# EAGLE design ahrs (EAGLE 7.7.0)
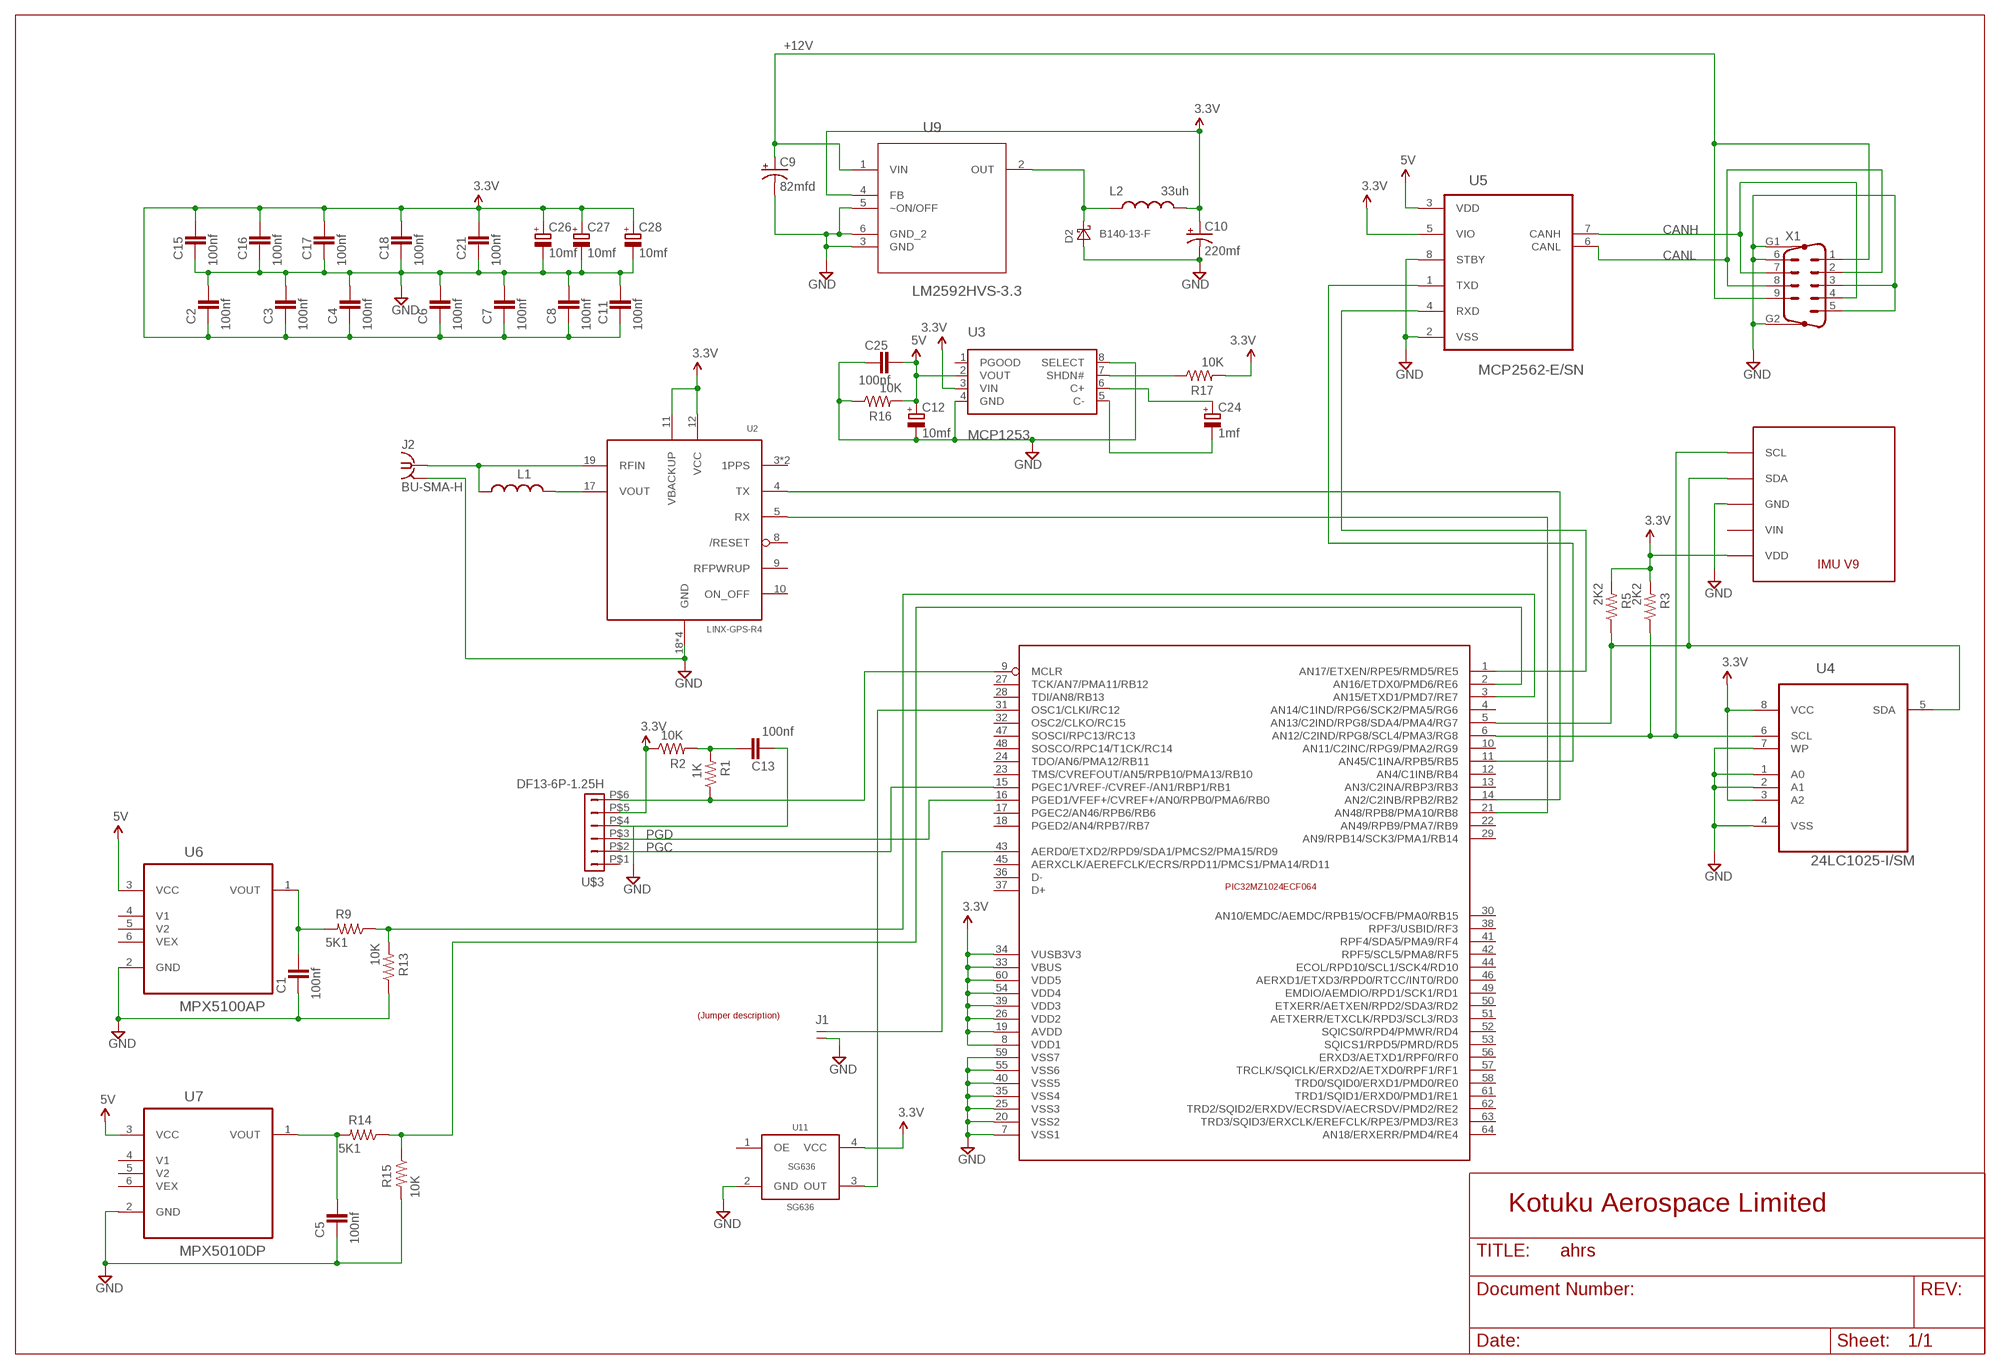
[diagram p0: schematic, sheet 1]

## Parts
C1  100nf  CAPACITOR_NPOL-0805  [C805]
C2  100nf  CAPACITOR_NPOL-0805  [C805]
C3  100nf  CAPACITOR_NPOL-0805  [C805]
C4  100nf  CAPACITOR_NPOL-0805  [C805]
C5  100nf  CAPACITOR_NPOL-0805  [C805]
C6  100nf  CAPACITOR_NPOL-0805  [C805]
C7  100nf  CAPACITOR_NPOL-0805  [C805]
C8  100nf  CAPACITOR_NPOL-0805  [C805]
C9  82mfd  CAPACITOR_POL-SVPF-E7  [SVPF-E7]
C10  220mf  CAP_POL7343  [EIA7343]
C11  100nf  CAPACITOR_NPOL-0805  [C805]
C12  10mf  CAPACITOR_POL-SMC_A  [SMC_A]
C13  100nf  CAPACITOR_NPOL-0805  [C805]
C15  100nf  CAPACITOR_NPOL-0805  [C805]
C16  100nf  CAPACITOR_NPOL-0805  [C805]
C17  100nf  CAPACITOR_NPOL-0805  [C805]
C18  100nf  CAPACITOR_NPOL-0805  [C805]
C21  100nf  CAPACITOR_NPOL-0805  [C805]
C24  1mf  CAPACITOR_POL-SMC_A  [SMC_A]
C25  100nf  CAPACITOR_NPOL-0805  [C805]
C26  10mf  CAPACITOR_POL-SMC_A  [SMC_A]
C27  10mf  CAPACITOR_POL-SMC_A  [SMC_A]
C28  10mf  CAPACITOR_POL-SMC_A  [SMC_A]
D2  B140-13-F  DIODE-SCHOTTKY-SMA  [SMA]
J1  JUMPER-1X2  [JUMPER-1X2]
J2  BU-SMA-H  [BU-SMA-H]
L1  FERRITE-0603  [FB603]
L2  33uh  INDUCTOR  [1812]
R1  1K  RESISTOR0603-RES  [0603-RES]
R2  10K  RESISTOR0603-RES  [0603-RES]
R3  2K2  RESISTOR0603-RES  [0603-RES]
R5  2K2  RESISTOR0603-RES  [0603-RES]
R9  5K1  RESISTOR0603-RES  [0603-RES]
R13  10K  RESISTOR0603-RES  [0603-RES]
R14  5K1  RESISTOR0603-RES  [0603-RES]
R15  10K  RESISTOR0603-RES  [0603-RES]
R16  10K  RESISTOR0603-RES  [0603-RES]
R17  10K  RESISTOR0603-RES  [0603-RES]
U2  LINX-GPS-R4  [LINX-R4]
U3  MCP1253  [MSOP8]
U4  24LC1025-I/SM  [SOIC8-N_MC]
U5  MCP2562-E/SN  [SOIC-8N]
U6  MPX5100AP  [FREESCALE_CASE_867B-04]
U7  MPX5010DP  MPX5100AP  [FREESCALE_CASE_867B-04]
U8  IMUV9  [IMUV9]
U9  LM2592HVS-3.3  LM2592HVS-5.0  [TO170P1435X457-5N]
U11  SG636  [SG636]
U$1  LABEL_JUMPER_1X2  [JUMP2_DESC]
U$2  PIC32MZ1024  [TQFP-64]
U$3  DF13-6P-1.25H  [DF13A-6P-1.25H]
X1  M09HP  [M09HP]

## Nets
3.3V: C2.2 C3.2 C4.2 C6.2 C7.2 C8.2 C10.A(+) C11.2 C15.1 C16.1 C17.1 C18.1 C21.1 C26.+ C27.+ C28.+ L2.2 R2.1 R3.2 R5.2 R17.2 U2.11(VBACKUP) U2.12(VCC) U3.3(VIN) U4.3(A2) U4.8(VCC) U5.5(VIO) U8.VDD U9.4(FB) U11.4(VCC) U$2.8(VDD1) U$2.19(AVDD) U$2.26(VDD2) U$2.33(VBUS) U$2.34(VUSB3V3) U$2.39(VDD3) U$2.54(VDD4) U$2.60(VDD5) U$3.P$5
5V: C12.+ C25.1 R16.2 U3.2(VOUT) U5.3(VDD) U6.3(VCC) U7.3(VCC)
!MCLR: R1.1 U$2.9(MCLR) U$3.P$6
+12V: C9.P$2(+) U9.1(VIN) X1.1 X1.9
CANH: U5.7(CANH) X1.4 X1.7
CANL: U5.6(CANL) X1.2 X1.8
GND: C1.2 C2.1 C3.1 C4.1 C5.2 C6.1 C7.1 C8.1 C9.P$1(-) C10.C(-) C11.1 C12.- C13.2 C15.2 C16.2 C17.2 C18.2 C21.2 C25.2 C26.- C27.- C28.- D2.A J1.2 J2.2 J2.3 J2.4 J2.5 R13.1 R15.2 R16.1 U2.18(GND) U2.20(GND) U2.21(GND) U2.22(GND) U3.4(GND) U3.8(SELECT) U4.1(A0) U4.2(A1) U4.4(VSS) U4.7(WP) U5.2(VSS) U5.8(STBY) U6.2(GND) U7.2(GND) U8.GND U9.3(GND) U9.5(~ON/OFF) U9.6(GND_2) U11.2(GND) U$2.7(VSS1) U$2.20(VSS2) U$2.25(VSS3) U$2.35(VSS4) U$2.40(VSS5) U$2.55(VSS6) U$2.59(VSS7) U$3.P$4 X1.3 X1.5 X1.6 X1.G1 X1.G2
N$1: L1.2 U2.17(VOUT)
N$2: J2.1 L1.1 U2.19(RFIN)
N$3: U5.4(RXD) U$2.1(AN17/ETXEN/RPE5/RMD5/RE5)
N$5: U11.3(OUT) U$2.31(OSC1/CLKI/RC12)
N$6: C13.1 R1.2 R2.2
N$7: C1.1 R9.2 U6.1(VOUT)
N$8: R9.1 R13.2 U$2.3(AN15/ETXD1/PMD7/RE7)
N$11: C5.1 R14.2 U7.1(VOUT)
N$12: D2.C L2.1 U9.2(OUT)
N$16: U2.4(TX) U$2.14(AN2/C2INB/RPB2/RB2)
N$20: U2.5(RX) U$2.21(AN48/RPB8/PMA10/RB8)
N$25: J1.1 U$2.43(AERD0/ETXD2/RPD9/SDA1/PMCS2/PMA15/RD9)
N$26: U5.1(TXD) U$2.11(AN45/C1INA/RPB5/RB5)
N$36: R17.1 U3.7(SHDN#)
N$37: C24.- U3.5(C-)
N$38: C24.+ U3.6(C+)
PGC: U$2.15(PGEC1/VREF-/CVREF-/AN1/RBP1/RB1) U$3.P$2
PGD: U$2.16(PGED1/VFEF+/CVREF+/AN0/RPB0/PMA6/RB0) U$3.P$3
PITOT: R14.1 R15.1 U$2.2(AN16/ETDX0/PMD6/RE6)
SCL: R3.1 U4.6(SCL) U8.SCL U$2.6(AN12/C2IND/RPG8/SCL4/PMA3/RG8)
SDA: R5.1 U4.5(SDA) U8.SDA U$2.5(AN13/C2IND/RPG8/SDA4/PMA4/RG7)
Unconnected: U2.3(1PPS) U2.7(1PPS) U2.8(/RESET) U2.9(RFPWRUP) U2.10(ON_OFF) U3.1(PGOOD) U6.4(V1) U6.5(V2) U6.6(VEX) U7.4(V1) U7.5(V2) U7.6(VEX) U11.1(OE) U$2.4(AN14/C1IND/RPG6/SCK2/PMA5/RG6) U$2.10(AN11/C2INC/RPG9/PMA2/RG9) U$2.12(AN4/C1INB/RB4) U$2.13(AN3/C2INA/RBP3/RB3) U$2.17(PGEC2/AN46/RPB6/RB6) U$2.18(PGED2/AN4/RPB7/RB7) U$2.22(AN49/RPB9/PMA7/RB9) U$2.23(TMS/CVREFOUT/AN5/RPB10/PMA13/RB10) U$2.24(TDO/AN6/PMA12/RB11) U$2.27(TCK/AN7/PMA11/RB12) U$2.28(TDI/AN8/RB13) U$2.29(AN9/RPB14/SCK3/PMA1/RB14) U$2.30(AN10/EMDC/AEMDC/RPB15/OCFB/PMA0/RB15) U$2.32(OSC2/CLKO/RC15) U$2.36(D-) U$2.37(D+) U$2.38(RPF3/USBID/RF3) U$2.41(RPF4/SDA5/PMA9/RF4) U$2.42(RPF5/SCL5/PMA8/RF5) U$2.44(ECOL/RPD10/SCL1/SCK4/RD10) U$2.45(AERXCLK/AEREFCLK/ECRS/RPD11/PMCS1/PMA14/RD11) U$2.46(AERXD1/ETXD3/RPD0/RTCC/INT0/RD0) U$2.47(SOSCI/RPC13/RC13) U$2.48(SOSCO/RPC14/T1CK/RC14) U$2.49(EMDIO/AEMDIO/RPD1/SCK1/RD1) U$2.50(ETXERR/AETXEN/RPD2/SDA3/RD2) U$2.51(AETXERR/ETXCLK/RPD3/SCL3/RD3) U$2.52(SQICS0/RPD4/PMWR/RD4) U$2.53(SQICS1/RPD5/PMRD/RD5) U$2.56(ERXD3/AETXD1/RPF0/RF0) U$2.57(TRCLK/SQICLK/ERXD2/AETXD0/RPF1/RF1) U$2.58(TRD0/SQID0/ERXD1/PMD0/RE0) U$2.61(TRD1/SQID1/ERXD0/PMD1/RE1) U$2.62(TRD2/SQID2/ERXDV/ECRSDV/AECRSDV/PMD2/RE2) U$2.63(TRD3/SQID3/ERXCLK/EREFCLK/RPE3/PMD3/RE3) U$2.64(AN18/ERXERR/PMD4/RE4) U$3.P$1

## Notes on the sheet
- Kotuku Aerospace Limited

## Power pins joined to a net without a drawn wire
VIN: U8.VIN

## Library data of the parts
C1-C8 C11 C13 C15-C18 C21 C25 = dp_devices:CAPACITOR_NPOL: Non-Polarized capacitor in various packages
C9 = kotuku:CAPACITOR_POL: Polarized capacitor in various packages
C10 = SparkFun:CAP_POL: Capacitor Polarized These are standard SMD and PTH capacitors. Normally 10uF, 47uF, and 100uF in electrolytic and tantalum varieties. Always verify the external diameter of the through hole cap, it varies with capacity, voltage, and manufacturer. The EIA devices should be standard.
C12 C24 C26-C28 = dp_devices:CAPACITOR_POL: Polarized capacitor in various packages
D2 = diode2:DIODE-SCHOTTKY-: SCHOTTKY DIODE
J1 = QuantumOptics:JUMPER-1X2: Jumper, header, SIP on 0.1" grid, for option selection.
J2 = con-coax:BU-SMA-H: FEMALE SMA CONNECTOR Radiall; OC_FARNELL: unknown; OC_NEWARK: unknown; PARTNO: 5-1814400-1
L1 = kotuku:FERRITE: Ferrite bead in various packages
L2 = SparkFun:INDUCTOR: Inductors Basic Inductor/Choke - 0603 and 1206. Footprints are not proven and vary greatly between part numbers.
R1-R3 R5 R9 R13-R17 = SparkFun-Passives:RESISTOR: Resistor Basic schematic elements and footprints for 0603, 1206, and PTH resistors.; PARTNO: ERJ-3GEYJ103V
U2 = Supernode-Sensors:LINX-GPS-R4; PARTNO: RXM-GPS-R4-T
U3 = microchip-dspic:MCP1253: Positive-Regulated Charge Pump (3.3x5.0)
U4 = Microchip_By_element14_Batch_1:24LC1025-I/SM: 1024K I2C CMOS Serial EEPROM
U5 = Microchip-MCP2562-E_SN:MCP2562-E/SN: High-Speed CAN Transceiver,SOIC-8
U6 U7 = MPX5100AP:MPX5100AP: IC, PRESSURE SENSOR, 0 TO 100KPA, SIP-6; MPN: MPX5100AP; OC_FARNELL: 1457156; OC_NEWARK: 07F9928; PACKAGE: CASE 867B-04; SUPPLIER: FREESCALE SEMICONDUCTOR
U8 = POLULU:IMUV9
U9 = NSC_By_element14_Batch_1.1:LM2592HVS-5.0: SIMPLE SWITCHER; MPN: LM2592HVS-5.0; OC_FARNELL: -; OC_NEWARK: 41K3791; PACKAGE: TO-263-5; SUPPLIER: National Semiconductor
U11 = epson:SG636; PARTNO: SG-636PCE 10.000MHZ
U$1 = dp_devices:LABEL_JUMPER_1X2: Nice formatted two legged jumperdescription Use attributes to change the values ON = With jumper OFF = Without jumper; OFF: Normal; ON: Reset
U$2 = PIC32MZ1024ECF064:PIC32MZ1024
U$3 = con-hirose-df13:DF13-6P-1.25: DF13-6P 1.25mm Pitch Miniature Crimping Connector.
X1 = con-subd:M09HP: SUB-D; OC_FARNELL: unknown; OC_NEWARK: unknown

## Net classes
0 default: width 0.152 mm, drill 0.305 mm, clearance 0.152 mm
2 12v: width 1.27 mm, drill 0.305 mm, clearance 0.305 mm

## Board
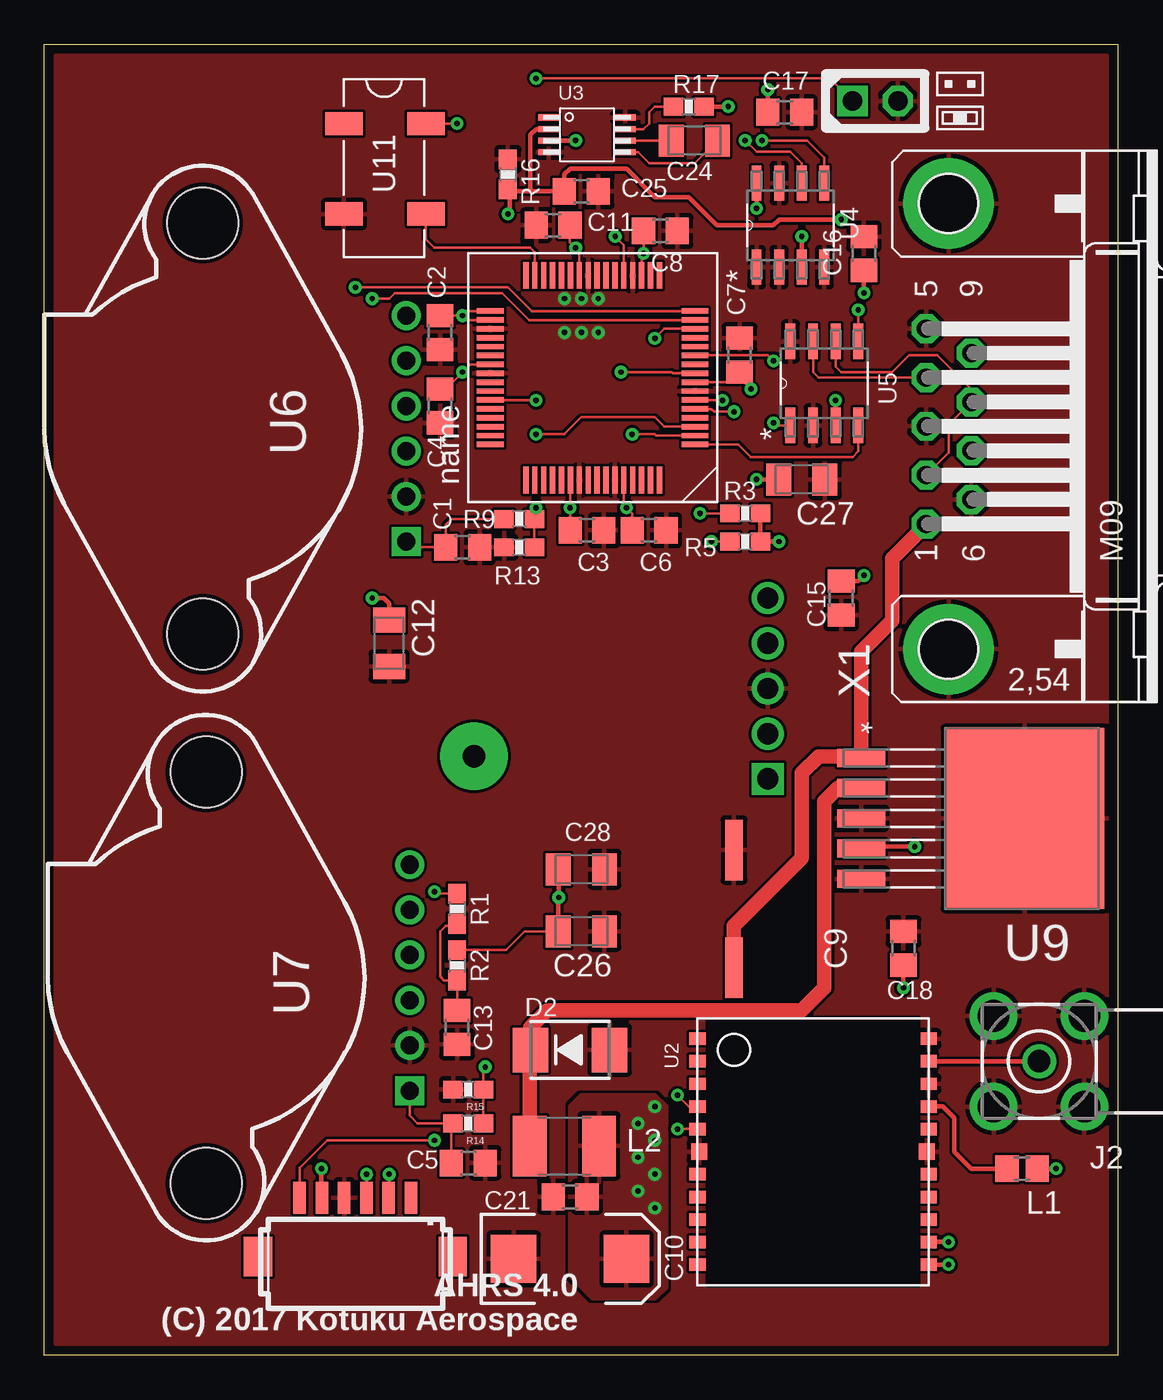
[diagram p1: board, top side]
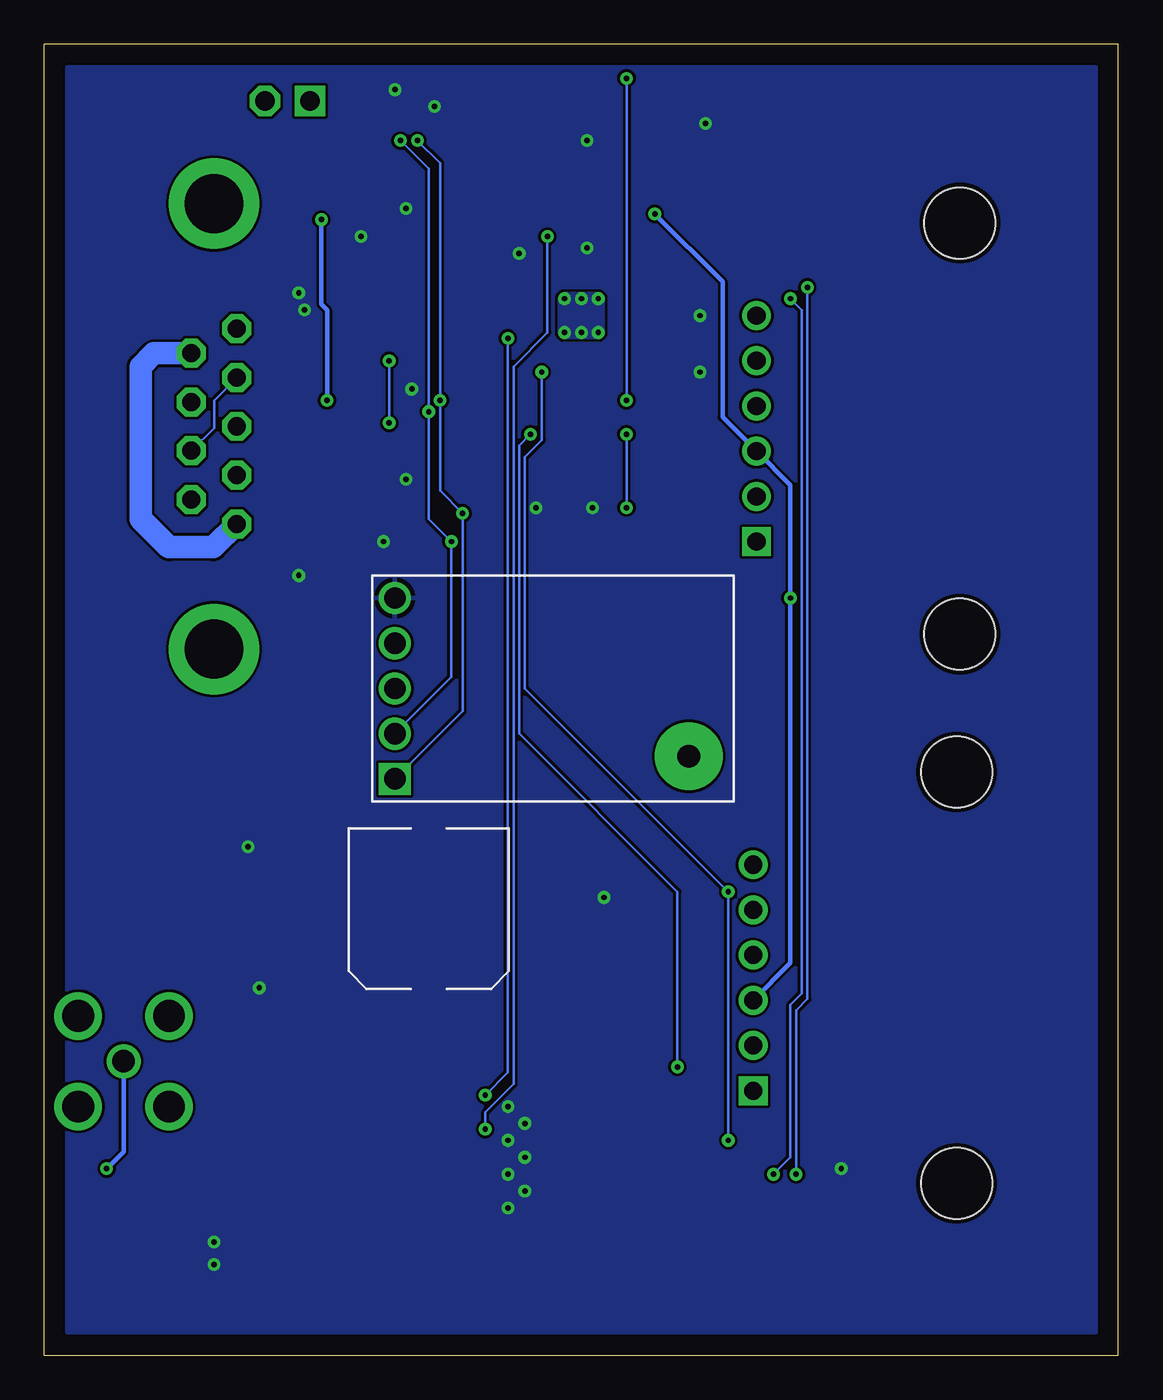
[diagram p2: board, bottom side, seen from below]

Size 60.33 x 73.66 mm. Coordinates in mm from the lower left corner, seen from the top.
Outline: 60.33,0 0,0 0,73.66 60.33,73.66 60.33,0
Copper layers (1*16): Top 0.035mm / dielectric 1.5mm / Bottom 0.035mm
Design rules "DFRobot_Eagle_Rule_v0.4": minimum track width 6mil, minimum drill 12mil, track to track 6mil, track to pad 6mil, pad to pad 6mil, via to via 6mil, smd to smd 0mil, copper to edge 10mil, drill to drill 10mil, minimum pad ring 12mil, minimum via ring 8mil, stop-mask expansion 2mil, vias tented up to drill 25mil, thermal gap 10mil

### Footprints (pad centres in the part's own frame; a part is rotated, then mirrored left to right if it is on the bottom)
C805 = smd 1.3 x 1.5: 1 -0.95,0; 2 0.95,0
SVPF-E7 = smd 1 x 3.4: P$1 0,3.3; P$2 0,-3.3
EIA7343 = smd 2.55 x 2.7: A 3.17,0; C -3.17,0
SMC_A = smd 1.4 x 1.8: + -1.3,0; - 1.3,0
SMA = smd 2 x 2.5: A 2.223,0; C -2.223,0
JUMPER-1X2 = drill 1.092 square: 1 0,2.54 | drill 1.092 octagon: 2 0,0
BU-SMA-H = drill 1.27: 1 0,0 | drill 1.778: 2 -2.55,2.55; 3 2.55,2.55; 4 2.55,-2.55; 5 -2.55,-2.55
FB603 = smd 1.3 x 1.5: 1 -0.85,0; 2 0.85,0
1812 = smd 1.9 x 3.4: 1 -1.95,0; 2 1.95,0
0603-RES = smd 1.1 x 1: 1 -0.85,0; 2 0.85,0
LINX-R4 = smd 0.7 x 0.92: 1 -6.35,-6.5; 2 -5.08,-6.5; 3 -3.81,-6.5; 4 -2.54,-6.5; 5 -1.27,-6.5; 6 1.27,-6.5; 7 2.54,-6.5; 8 3.81,-6.5; 9 5.08,-6.5; 10 6.35,-6.5; 11 6.35,6.5; 12 5.08,6.5; 13 3.81,6.5; 14 2.54,6.5; 15 1.27,6.5; 16 -1.27,6.5; 17 -2.54,6.5; 18 -3.81,6.5; 19 -5.08,6.5; 20 -6.35,6.5 | smd 0.92 x 0.92: 21 0,-6.39; 22 0,6.39
MSOP8 = smd 1.2 x 0.35: 1 -2.145,0.975; 2 -2.145,0.325; 3 -2.145,-0.325; 4 -2.145,-0.975; 5 2.145,-0.975; 6 2.145,-0.325; 7 2.145,0.325; 8 2.145,0.975
SOIC8-N_MC = smd 1.981 x 0.559: 1 -2.362,1.905; 2 -2.362,0.635; 3 -2.362,-0.635; 4 -2.362,-1.905; 5 2.362,-1.905; 6 2.362,-0.635; 7 2.362,0.635; 8 2.362,1.905
SOIC-8N = smd 1.981 x 0.559: 1 1.448,5.715; 2 1.448,4.445; 3 1.448,3.175; 4 1.448,1.905; 5 6.172,1.905; 6 6.172,3.175; 7 6.172,4.445; 8 6.172,5.715
FREESCALE_CASE_867B-04 = drill 1.016 square: 1 -12.7,2.54 | drill 1.016: 2 -10.16,2.54; 3 -7.62,2.54; 4 -5.08,2.54; 5 -2.54,2.54; 6 0,2.54 | hole 4: 5.205,13.97; -17.905,13.97
IMUV9 = drill 1.2: GND 0,-5.08; SDA 0,-2.54; VDD 0,-10.16; VIN 0,-7.62 | drill 1.27 pad 3.81: P$1 16.51,-1.27 | drill 1.2 square: SCL 0,0
TO170P1435X457-5N = smd 1.016 x 2.692: 1 -3.404,-9.042; 2 -1.702,-9.042; 3 0,-9.042; 4 1.702,-9.042; 5 3.404,-9.042 | smd 10.16 x 8.941: 6 0,0.152
SG636 = smd 1.3 x 2.1: 1 0,0; 2 5.08,0; 3 5.08,4.6; 4 0,4.6
TQFP-64 = smd 0.3 x 1.5: 1 -3.75,-5.75; 2 -3.25,-5.75; 3 -2.75,-5.75; 4 -2.25,-5.75; 5 -1.75,-5.75; 6 -1.25,-5.75; 7 -0.75,-5.75; 8 -0.25,-5.75; 9 0.25,-5.75; 10 0.75,-5.75; 11 1.25,-5.75; 12 1.75,-5.75; 13 2.25,-5.75; 14 2.75,-5.75; 15 3.25,-5.75; 16 3.75,-5.75; 33 3.75,5.75; 34 3.25,5.75; 35 2.75,5.75; 36 2.25,5.75; 37 1.75,5.75; 38 1.25,5.75; 39 0.75,5.75; 40 0.25,5.75; 41 -0.25,5.75; 42 -0.75,5.75; 43 -1.25,5.75; 44 -1.75,5.75; 45 -2.25,5.75; 46 -2.75,5.75; 47 -3.25,5.75; 48 -3.75,5.75 | smd 1.5 x 0.3: 17 5.75,-3.75; 18 5.75,-3.25; 19 5.75,-2.75; 20 5.75,-2.25; 21 5.75,-1.75; 22 5.75,-1.25; 23 5.75,-0.75; 24 5.75,-0.25; 25 5.75,0.25; 26 5.75,0.75; 27 5.75,1.25; 28 5.75,1.75; 29 5.75,2.25; 30 5.75,2.75; 31 5.75,3.25; 32 5.75,3.75; 49 -5.75,3.75; 50 -5.75,3.25; 51 -5.75,2.75; 52 -5.75,2.25; 53 -5.75,1.75; 54 -5.75,1.25; 55 -5.75,0.75; 56 -5.75,0.25; 57 -5.75,-0.25; 58 -5.75,-0.75; 59 -5.75,-1.25; 60 -5.75,-1.75; 61 -5.75,-2.25; 62 -5.75,-2.75; 63 -5.75,-3.25; 64 -5.75,-3.75
DF13A-6P-1.25H = smd 1.6 x 2.2: M$0 -5.475,2.4; M$1 5.475,2.4 | smd 0.7 x 1.8: P$1 -3.125,-0.9; P$2 -1.875,-0.9; P$3 -0.625,-0.9; P$4 0.625,-0.9; P$5 1.875,-0.9; P$6 3.125,-0.9
M09HP = drill 1.016 octagon: 1 -5.486,1.27; 2 -2.743,1.27; 3 0,1.27; 4 2.743,1.27; 5 5.486,1.27; 6 -4.115,-1.27; 7 -1.372,-1.27; 8 1.372,-1.27; 9 4.115,-1.27 | drill 3.302 pad 5.08: G1 -12.522,0; G2 12.522,0

### Placement (x,y rotation side)
C1  23.5,45.4 0 top
C2  22.23,57.47 90 top
C3  30.48,46.35 180 top
C4  22.23,53.34 90 top
C5  23.81,10.79 0 top
C6  33.97,46.35 180 top
C7  39.05,56.2 270 top
C8  34.61,63.18 180 top
C9  38.73,25.08 0 top
C10  29.53,5.4 0 top
C11  28.57,63.5 0 top
C12  19.37,40.01 270 top
C13  23.18,18.41 270 top
C15  44.77,42.55 270 top
C16  46.04,61.91 90 top
C17  41.59,69.85 0 top
C18  48.26,22.86 90 top
C21  29.53,8.89 180 top
C24  36.51,68.26 0 top
C25  30.16,65.41 0 top
C26  30.16,23.81 0 top
C27  42.55,49.21 0 top
C28  30.16,27.3 0 top
D2  29.53,17.14 0 top
J1  47.94,70.48 90 top
J2  55.88,16.51 0 top
L1  54.93,10.48 180 top
L2  29.21,11.75 0 top
R1  23.18,25.08 270 top
R2  23.18,21.91 270 top
R3  39.37,47.31 0 top
R5  39.37,45.72 0 top
R9  26.67,46.99 180 top
R13  26.67,45.4 0 top
R14  23.81,13.02 180 top
R15  23.81,14.92 180 top
R16  26.04,66.36 270 top
R17  36.2,70.17 0 top
U2  43.18,11.43 270 top
U3  30.48,68.58 0 top
U4  41.91,63.5 90 top
U5  47.62,50.8 90 top
U6  22.86,58.42 90 top
U7  23.05,27.56 90 top
U8  40.64,32.38 180 top
U9  54.93,30.16 270 top
U11  16.83,69.22 270 top
U$1  53.98,70.17 0 top
U$2  30.8,54.93 90 top
U$3  17.46,7.94 180 top
X1  50.8,52.2 90 top

### Tracks (layer width: path | path; a pad name or v marks a point on that pad's centre or on a via)
3.3V  (via drill 0.3)
  Top 0.152: U11.4 v23.18,69.22 | U5.5 v45.72,58.74 | U$2.54 29.55,47.65 v29.53,47.62 C3.2 | U$2.60 32.55,47.78 v32.7,47.62 33.02,47.3 C6.2 | U$2.39 23.93,55.68 v23.5,55.24 22.54,54.29 C4.2 | U$2.33 23.75,58.68 v23.5,58.42 | U$2.34 23.74,58.18 v23.5,58.42 | C2.2 v23.49,58.42 v23.5,58.42 | U$2.19 33.55,61.8 v33.66,61.91 C8.2 | U$2.26 30.05,62.03 v29.84,62.23 29.52,62.55 C11.2 | v39.69,54.29 39.05,54.93 C7.2 38.48,54.68 U$2.8 | C26.+ 26.99,23.81 25.93,22.76 R2.1
  Top 0.254: C16.1 v46.04,59.69 | C27.+ v40.01,49.21 | U4.8 v40.01,64.45 | R17.2 v38.42,70.17 | C17.1 v40.64,71.12 | U3.3 28.34,68.26 v29.84,68.26 | U4.3 v42.55,62.87 | R3.2 R5.2 v41.27,45.72 | C15.1 45.72,43.5 v46.04,43.81 | U2.12 v50.8,6.35 | U2.11 v50.8,5.08 | C18.1 v48.26,20.64 | C28.+ 28.89,27.27 v28.89,25.72 28.86,25.69 C26.+ | U9.4 46.63,28.57 v48.9,28.57 | U$3.P$5 15.56,8.84 v15.56,10.48
  other vias: 34.29,13.97 33.34,13.02 34.29,12.06 33.34,11.11 34.29,10.16 33.34,9.21 34.29,8.26
  pour Top: 29.53,13.97 30.16,14.61 34.29,14.61 34.92,13.97 34.92,3.81 34.29,3.17 30.8,3.17 29.53,4.45
  pour Bottom (rank 4): 1.27,72.39 59.05,72.39 59.05,1.27 1.27,1.27
5V  (via drill 0.3)
  Top 0.254: U3.2 27.63,68.91 27.3,68.58 27.3,65.41 | 27.3,65.41 26.14,65.41 | 26.14,65.41 R16.2 | 27.3,65.41 C25.1 29.21,66.36 29.53,66.67 32.7,66.67 34.29,65.09 36.2,65.09 37.78,63.5 40.96,63.5 41.27,63.82 v44.77,63.82 | 26.14,65.41 26.14,64.24 v26.04,64.14 | v18.41,42.55 19.05,42.55 19.37,42.23 C12.+ | v44.45,53.66 U5.3
  Bottom 0.254: v26.04,64.14 22.23,60.33 22.23,52.7 U6.3 18.41,48.9 v18.41,42.55 18.41,22.04 U7.3 | v44.77,63.82 44.77,59.05 44.45,58.74 v44.45,53.66
!MCLR  (via drill 0.3)
  Top 0.152: U$3.P$6 14.34,10.53 15.88,12.06 v21.91,12.06 | v32.38,55.24 35.24,55.24 35.31,55.18 U$2.9 | v21.91,26.04 22.01,25.93 R1.1
  Bottom 0.152: v21.91,12.06 v21.91,26.04 33.34,37.47 33.34,50.48 32.38,51.44 v32.38,55.24
+12V
  Top 0.813: C9.P$2 38.73,24.13 42.55,27.94 42.55,32.7 43.5,33.66 46.43,33.66 U9.1 45.88,39.53 47.62,41.27 47.62,44.77 49.53,46.67 X1.1
  Bottom 1.27: X1.1 50.84,45.4 53.34,45.4 54.93,46.99 54.93,55.56 54.18,56.31 X1.9
CANH
  Top 0.152: U5.7 43.18,55.24 43.5,54.93 49.52,54.93 X1.4
  Bottom 0.152: X1.4 49.53,54.93 50.8,53.66 50.8,52.09 X1.7
CANL
  Top 0.152: U5.6 44.45,55.56 44.77,55.24 47.62,55.24 48.58,56.2 50.16,56.2 52.07,54.29 X1.8 50.8,52.3 50.8,50.72 X1.2
GND  (via drill 0.3)
  other vias: 29.21,57.47 30.16,57.47 31.11,57.47 29.21,59.37 30.16,59.37 31.11,59.37
  pour Top (rank 6): 0.64,73.03 59.69,73.03 59.69,65.41 59.69,0.64 0.64,0.64
  pour Bottom: 29.21,59.69 28.89,59.37 28.89,57.47 29.21,57.15 31.11,57.15 31.43,57.47 31.43,59.37 31.11,59.69
N$1
  Top 0.254: U2.17 50.48,13.97 51.12,13.34 51.12,11.43 52.07,10.48 L1.2
N$2  (via drill 0.3)
  Top 0.254: U2.19 J2.1 | L1.1 v56.83,10.48
  Bottom 0.254: v56.83,10.48 55.88,11.43 J2.1
N$3
  Top 0.152: U$2.1 38.99,51.18 39.69,50.48 45.4,50.48 45.72,50.8 U5.4
N$4
  cutout Top: 37.15,19.05 37.15,3.81 49.21,3.81 49.21,19.05
N$5
  Top 0.152: U$2.31 27.55,61.99 27.3,62.23 21.91,62.23 21.43,62.71 U11.3
N$6
  Top 0.152: C13.1 R2.2 22.44,21.06 22.23,21.27 22.23,23.81 22.54,24.13 23.07,24.13 R1.2
N$7
  Top 0.152: 22.23,45.72 C1.1 | U6.1 20.64,45.4 C1.1 | C1.1 22.54,46.67 22.86,46.99 R9.2
N$8  (via drill 0.3)
  Top 0.152: v27.62,47.62 27.62,47.09 R9.1 R13.2 | v27.62,51.75 29.21,51.75 30.16,52.7 34.29,52.7 34.82,52.18 U$2.3
  Bottom 0.152: v27.62,47.62 v27.62,51.75
N$11
  Top 0.152: U7.1 20.51,13.46 20.95,13.02 R14.2 22.86,12.92 C5.1
N$12
  Top 0.813: U9.2 44.56,31.86 43.81,31.11 43.81,20.64 42.55,19.37 28.26,19.37 27.3,18.41 D2.C 27.26,17.1 L2.1
N$16  (via drill 0.3)
  Top 0.152: U2.4 36.2,13.97 v35.56,14.61 | v34.29,57.15 34.82,57.68 U$2.14
  Bottom 0.152: v35.56,14.61 34.29,15.88 v34.29,57.15
N$20  (via drill 0.3)
  Top 0.152: U2.5 v35.56,12.7 | U$2.21 32.55,62.39 v32.07,62.87
  Bottom 0.152: v35.56,12.7 35.56,13.65 33.97,15.24 33.97,55.56 32.07,57.47 v32.07,62.87
N$25  (via drill 0.3)
  Top 0.152: J1.1 44.13,71.75 v27.62,71.75 | v27.62,53.66 27.6,53.68 U$2.43
  Bottom 0.152: v27.62,71.75 v27.62,53.66
N$26  (via drill 0.3)
  Top 0.152: U$2.11 36.57,56.2 40.64,56.2 v40.96,55.88 | v40.96,52.39 41.1,52.25 U5.1
  Bottom 0.152: v40.96,55.88 v40.96,52.39
N$36
  Top 0.152: U3.7 33.65,68.91 33.66,68.9 33.97,69.22 33.97,69.85 34.29,70.17 R17.1
N$37
  Top 0.152: U3.5 33.36,67.61 33.97,66.99 36.54,66.99 C24.-
N$38
  Top 0.152: U3.6 32.63,68.26 C24.+
PGC  (via drill 0.3)
  Top 0.152: U$3.P$2 19.37,8.87 v19.37,10.16 | v18.41,59.37 19.37,59.37 19.68,59.69 25.72,59.69 27.23,58.18 U$2.15
  Bottom 0.152: v19.37,10.16 18.41,11.11 18.41,19.68 17.78,20.32 17.78,58.74 v18.41,59.37
PGD  (via drill 0.3)
  Top 0.152: U$3.P$3 v18.1,10.16 | v17.46,60.01 26.04,60.01 27.36,58.68 U$2.16
  Bottom 0.152: v18.1,10.16 18.1,19.37 17.46,20 v17.46,60.01
PITOT  (via drill 0.3)
  Top 0.152: R14.1 R15.1 24.66,16.09 v24.77,16.19 | U$2.2 34.37,51.68 34.29,51.75 v33.02,51.75
  Bottom 0.152: v24.77,16.19 24.77,26.04 33.66,34.92 33.66,51.12 v33.02,51.75
SCL  (via drill 0.3)
  Top 0.152: v36.83,47.31 R3.1 | U$2.6 37.8,53.68 v38.1,53.66 | v39.37,68.26 40.01,67.63 41.91,67.63 42.55,66.99 U4.6
  Bottom 0.152: U8.SCL 36.83,36.2 v36.83,47.31 38.1,48.58 v38.1,53.66 38.1,66.99 v39.37,68.26
SDA  (via drill 0.3)
  Top 0.152: v37.47,45.72 R5.1 | U$2.5 37.47,53.18 37.62,53.02 v38.73,53.02 | U4.5 43.81,67.31 42.86,68.26 v40.32,68.26
  Bottom 0.152: U8.SDA 37.47,38.1 v37.47,45.72 38.73,46.99 v38.73,53.02 38.73,66.67 v40.32,68.26

### Text on the board
tPlace: AHRS 4.0 / (C) 2017 Kotuku Aerospace